# EAGLE design HiLoRelay (EAGLE 6.5.0)
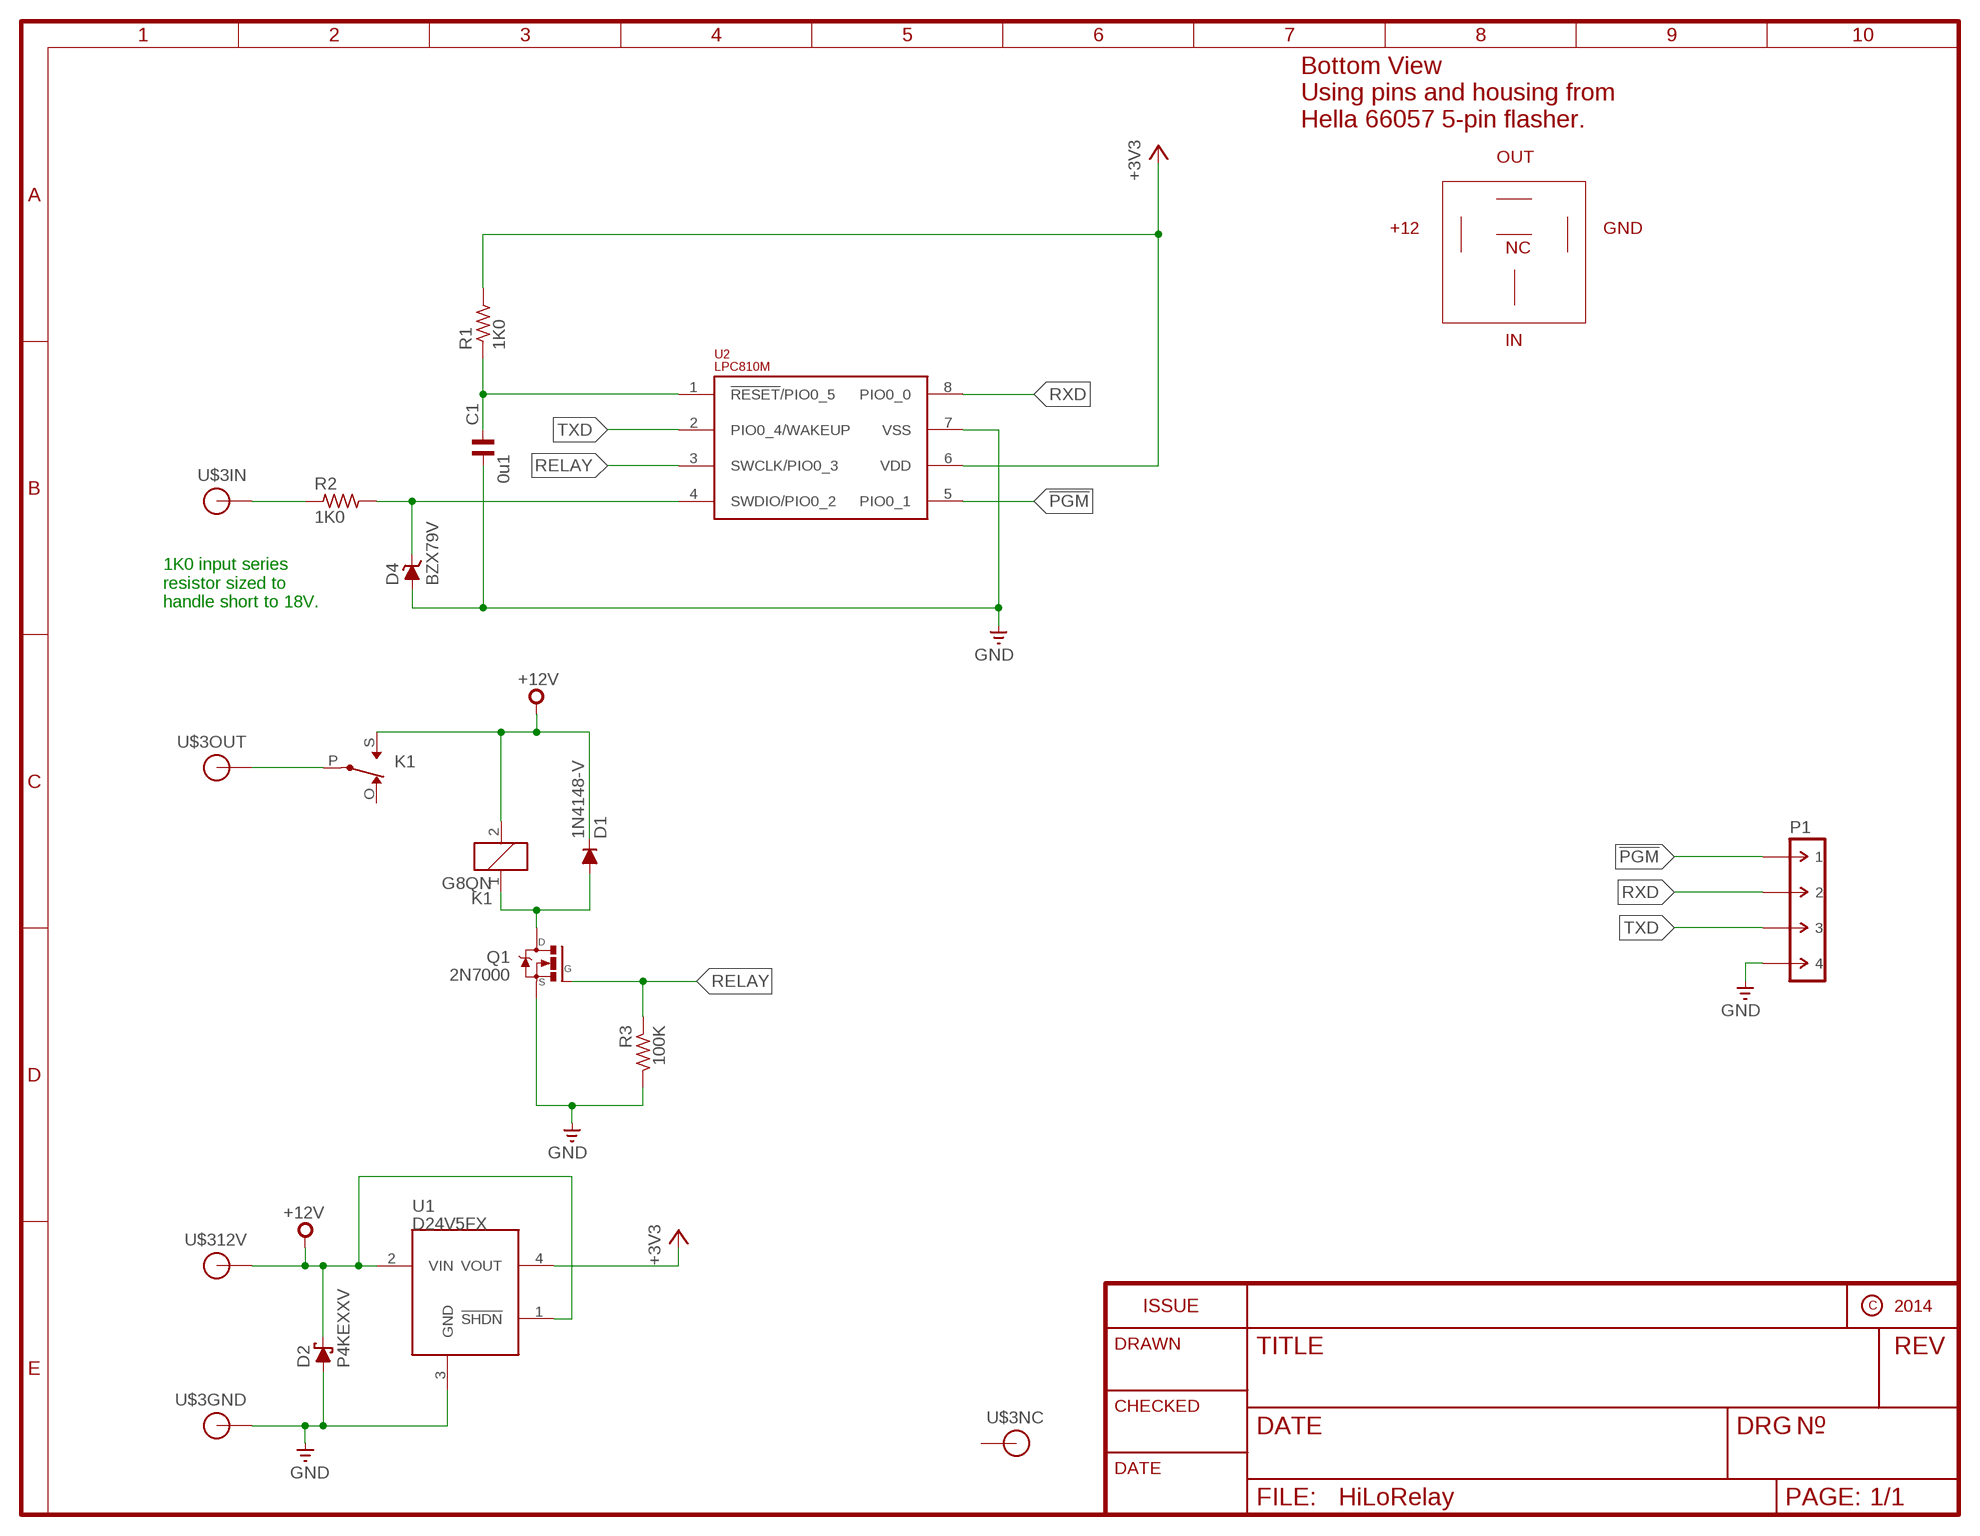
[diagram p0: schematic, sheet 1]

## Parts
C1  0u1  C-EU025-024X044  [C025-024X044]
D1  1N4148-V  [DO35-V]
D2  P4KEXXV  [DO41-V]
D4  BZX79V  [DO35-V]
K1  G8QN  [G8QN]
P1  M-1X04-SIP-100-32  [SIP-100-04-32]
Q1  2N7000  [TO-92]
R1  1K0  R-EU_0207/2V  [0207/2V]
R2  1K0  R-EU_0207/2V  [0207/2V]
R3  100K  R-EU_0207/2V  [0207/2V]
U1  D24V5FX  [SIP-100-04-32]
U2  LPC810M  [DIL08]
U$3  TRIDON_PIN_BASE  [TRIDON_PIN_BASE]

## Nets
!PGM: P1.1 U2.5(PIO0_1)
+3V3: R1.2 U1.4(VOUT) U2.6(VDD)
+12V: D1.C D2.C K1.2 K1.S(2:NO) U1.1(!SHDN) U1.2(VIN) U$3.12V
GND: C1.2 D2.A D4.A P1.4 Q1.1(S) R3.2 U1.3(GND) U2.7(VSS) U$3.GND
N$1: D1.A K1.1 Q1.3(D)
N$2: R2.1 U$3.IN
N$3: D4.C R2.2 U2.4(SWDIO/PIO0_2)
N$4: C1.1 R1.1 U2.1(!RESET!/PIO0_5)
OUT: K1.P(2:COM) U$3.OUT
RELAY: Q1.2(G) R3.1 U2.3(SWCLK/PIO0_3)
RXD: P1.2 U2.8(PIO0_0)
TXD: P1.3 U2.2(PIO0_4/WAKEUP)
Unconnected: K1.O(2:NC) U$3.NC

## Notes on the sheet
- Bottom View
  Using pins and housing from
  Hella 66057 5-pin flasher.
- OUT
- +12 | GND
- NC
- IN
- 1K0 input series
  resistor sized to
  handle short to 18V.

## Library data of the parts
C1 = custom:C-EU: CAPACITOR, European symbol; PARTNO: FK18X7R1E104K
D1 = custom:1N4148: DIODE high speed (Philips); PARTNO: 1N4148
D2 = custom:P4KEXX: DIODE transient-voltage suppressor; PARTNO: P4KE30CA
D4 = custom:BZX79: Z DIODE; PARTNO: TZX3V3A-TR
K1 = custom:G8QN: RELAY 1 x switch; PARTNO: G8QN-1C4-DC12
P1 = custom:M-1X04-: MALE HEADER; PARTNO: 961104-6404-AR
Q1 = custom:2N7000: N-Channel MOSFET; PARTNO: 2N7000
R1 R2 = custom:R-EU_: RESISTOR, European symbol; PARTNO: MFR-25FBF52-1K
R3 = custom:R-EU_: RESISTOR, European symbol; PARTNO: MFR-25FRF52-100K
U1 = custom:D24V5FX; BOM: EXCLUDE
U2 = custom:LPC810M: ARM Cortex-M0 in 8-pin DIP; PARTNO: LPC810M021FN8FP
U$3 = custom:TRIDON_PIN_BASE; BOM: EXCLUDE

## Board
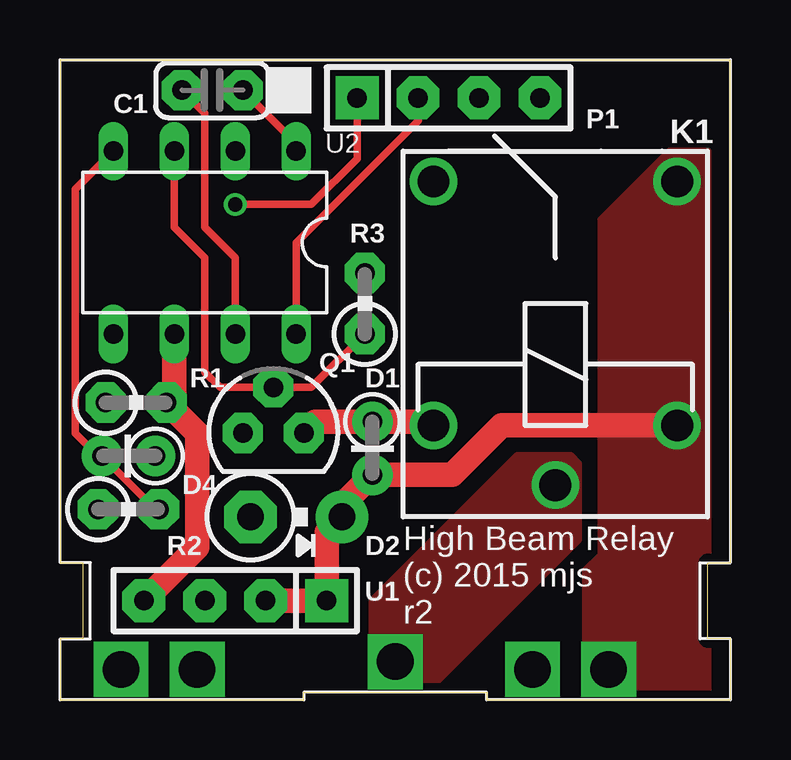
[diagram p1: board, top side]
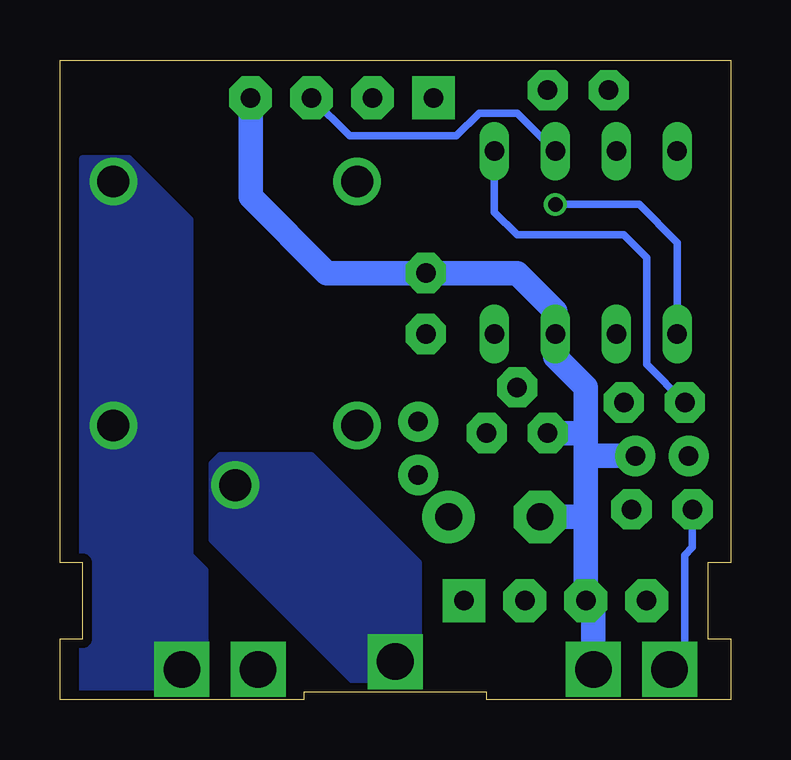
[diagram p2: board, bottom side, seen from below]

Size 27.94 x 26.66 mm. Coordinates in mm from the lower left corner, seen from the top.
Outline: 0,0 10.16,0 10.16,0.32 17.78,0.32 17.78,0 27.94,0 27.94,2.54 26.99,2.54 26.99,5.71 27.94,5.71 27.92,26.66 0,26.66 0,5.71 0.95,5.71 0.95,2.54 0,2.54 0,0
Copper layers (1*16): Top 0.0356mm / dielectric 1.5011mm / Bottom 0.0356mm
Design rules "LaenPCBOrder": minimum track width 6mil, minimum drill 13mil, track to track 6mil, track to pad 6mil, pad to pad 6mil, via to via 6mil, smd to smd 6mil, copper to edge 15mil, drill to drill 6mil, minimum pad ring 7mil, minimum via ring 7mil, stop-mask expansion 3mil, vias tented up to drill 0mil, thermal gap 10mil

### Footprints (pad centres in the part's own frame; a part is rotated, then mirrored left to right if it is on the bottom)
C025-024X044 = drill 0.813 pad 1.676 octagon: 1 -1.27,0; 2 1.27,0
DO35-V = drill 0.813 pad 1.676: A 1.111,0; C -1.111,0
DO41-V = drill 1.118 pad 2.184 octagon: A 2.54,0 | drill 1.118 pad 2.184: C -1.27,0
G8QN = drill 1.321: 1 -5.08,5.08; 2 -5.08,-5.08; O 5.08,5.08; P -7.569,0; S 5.08,-5.08
SIP-100-04-32 = drill 0.813 pad 1.778 square: 1 -3.81,0 | drill 0.813 pad 1.778 octagon: 2 -1.27,0; 3 1.27,0; 4 3.81,0
TO-92 = drill 0.813 pad 1.676 octagon: 1 -1.27,0; 2 0,1.905; 3 1.27,0
0207/2V = drill 0.813 pad 1.676 octagon: 1 -1.27,0; 2 1.27,0
DIL08 = drill 0.813 long: 1 -3.81,-3.81; 2 -1.27,-3.81; 3 1.27,-3.81; 4 3.81,-3.81; 5 3.81,3.81; 6 1.27,3.81; 7 -1.27,3.81; 8 -3.81,3.81
TRIDON_PIN_BASE = drill 1.524 pad 1.93 square: 12V 22.86,1.27; GND 5.715,1.27; IN 2.54,1.27; NC 19.685,1.27; OUT 13.97,1.587

### Placement (x,y rotation side)
C1  6.35,25.4 180 top
D1  13.02,10.48 90 top
D2  10.48,7.62 180 top
D4  2.86,10.16 0 top
K1  20.64,16.51 90 top
P1  16.19,25.08 0 top
Q1  8.89,11.11 0 top
R1  3.17,12.38 0 top
R2  2.86,7.94 0 top
R3  12.7,16.51 90 top
U1  7.3,4.13 180 top
U2  6.03,19.05 180 top
U$3  0,0 0 top

### Tracks (layer width: path | path; a pad name or v marks a point on that pad's centre or on a via)
!PGM  (via drill 0.6)
  Top 0.305: P1.1 12.38,22.54 10.48,20.64 v7.3,20.64
  Bottom 0.305: v7.3,20.64 3.81,20.64 2.22,19.05 U2.5
+3V3
  Top 0.305: R1.2 4.76,12.7
  Top 1.016: U2.6 4.76,12.7 4.76,12.06 5.71,11.11 5.71,6.35 U1.4
+12V
  Top 1.016: K1.2 18.41,11.43 16.35,9.37 D1.C 11.75,8.1 D2.C 11.11,6.99 U1.1 U1.2
  pour Bottom (no thermals): 21.91,0.32 21.91,5.4 22.54,6.03 22.54,20 25.08,22.54 26.99,22.54 26.99,0.32
  pour Top (no thermals): 21.91,0.32 21.91,5.4 22.54,6.03 22.54,20 25.4,22.86 26.99,22.86 26.99,0.32
GND
  Top 0.305: C1.2 6.03,24.45 6.03,19.68 7.3,18.41 U2.7
  Bottom 1.016: 6.03,11.11 6.03,13.02 7.3,14.29 U2.7 7.3,16.19 8.89,17.78 R3.2 16.83,17.78 20,20.95 P1.4 | 6.03,11.11 6.03,10.16 | 6.03,10.16 6.03,7.62 | 6.03,7.62 U1.3 5.71,3.81 U$3.GND | Q1.1 6.03,11.11 | D4.A 6.03,10.16 | D2.A 6.03,7.62
N$1
  Top 1.016: K1.1 15.4,11.59 D1.A 10.64,11.59 Q1.3
N$2
  Bottom 0.305: R2.1 1.59,6.35 1.91,6.03 1.91,1.91 U$3.IN
N$3
  Top 0.305: R2.2 3.97,7.94 D4.C 1.59,10.16 0.64,11.11 0.64,21.27 U2.4
N$4
  Top 0.305: U2.1 9.84,23.18 C1.1
  Bottom 0.305: R1.1 3.49,13.97 3.49,18.41 4.45,19.37 8.89,19.37 9.84,20.32 U2.1
OUT
  pour Bottom (no thermals): 13.02,0.64 13.02,5.71 17.46,10.16 21.27,10.16 21.59,9.84 21.59,6.67 15.56,0.64
  pour Top (no thermals): 13.02,0.64 13.02,4.13 19.05,10.16 21.27,10.16 21.59,9.84 21.59,6.67 15.56,0.64
RELAY
  Top 0.305: U2.3 4.76,19.68 6.03,18.41 6.03,13.65 6.67,13.02 Q1.2 10.48,13.02 R3.1
RXD
  Top 0.305: P1.2 14.92,24.13 9.84,19.05 U2.8
TXD
  Bottom 0.305: U2.2 8.89,24.45 10.48,24.45 11.43,23.5 15.88,23.5 P1.3

### Text on the board
tNames: High Beam Relay / (c) 2015 mjs / r2